# EAGLE design midi_CasioSA21.v4 (EAGLE 7.7.0)
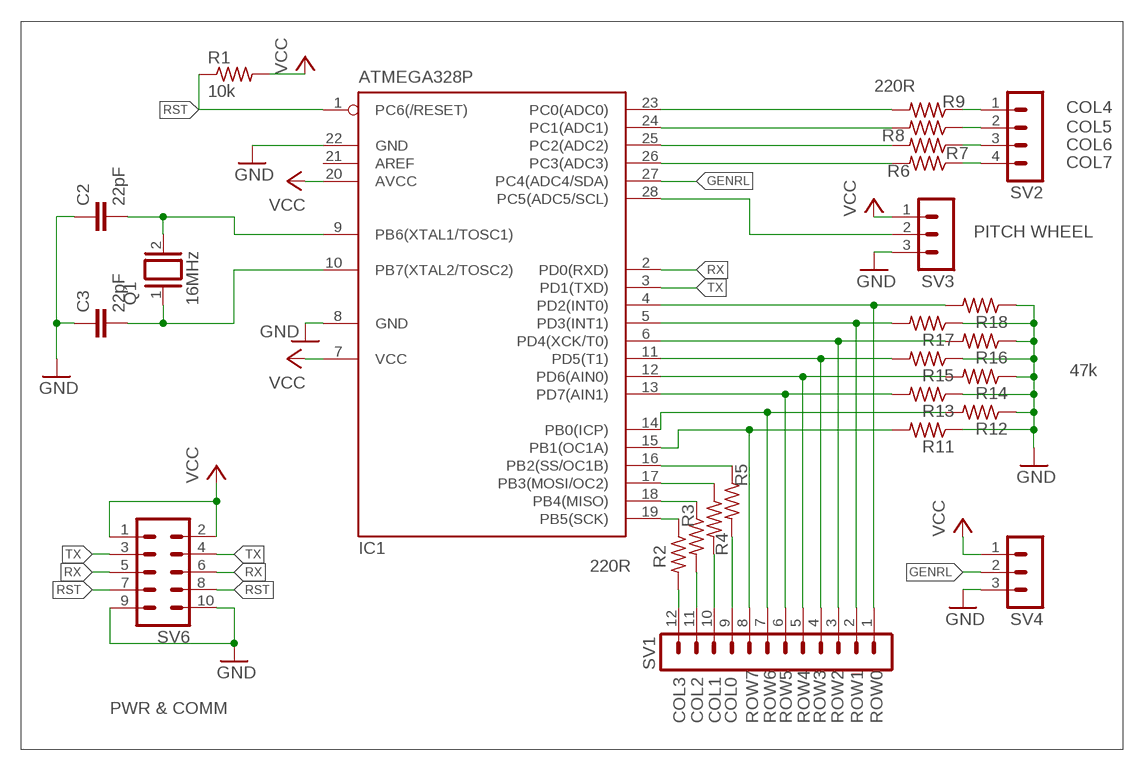
[diagram p0: schematic, sheet 1]

## Parts
C2  22pF  C-EU025-025X050  [C025-025X050]
C3  22pF  C-EU025-025X050  [C025-025X050]
IC1  ATMEGA328P  MEGA8-P  [DIL28-3]
Q1  16MHz  XTAL/S  [QS]
R1  10k  R-US_0204/7  [0204/7]
R2  R-US_0204/5  [0204/5]
R3  R-US_0204/2V  [0204V]
R4  R-US_0204/2V  [0204V]
R5  R-US_0204/2V  [0204V]
R6  R-US_0204/5  [0204/5]
R7  R-US_0204/5  [0204/5]
R8  R-US_0204/5  [0204/5]
R9  R-US_0204/5  [0204/5]
R11  R-US_0204/5  [0204/5]
R12  R-US_0204/5  [0204/5]
R13  R-US_0204/5  [0204/5]
R14  R-US_0204/5  [0204/5]
R15  R-US_0204/5  [0204/5]
R16  R-US_0204/5  [0204/5]
R17  R-US_0204/5  [0204/5]
R18  R-US_0204/5  [0204/5]
SV1  MA12-1  [MA12-1]
SV2  MA04-1  [MA04-1]
SV3  MA03-1  [MA03-1]
SV4  MA03-1  [MA03-1]
SV6  MA05-2  [MA05-2]

## Nets
GENRL: IC1.27(PC4(ADC4/SDA)) SV4.2
GND: C2.1 C3.1 IC1.8(GND) IC1.22(GND) R11.1 R12.1 R13.1 R14.1 R15.1 R16.1 R17.1 R18.1 SV3.3 SV4.3 SV6.9 SV6.10
N$1: C2.2 IC1.9(PB6(XTAL1/TOSC1)) Q1.2
N$2: C3.2 IC1.10(PB7(XTAL2/TOSC2)) Q1.1
N$3: IC1.4(PD2(INT0)) R18.2 SV1.1
N$4: IC1.5(PD3(INT1)) R17.2 SV1.2
N$5: IC1.6(PD4(XCK/T0)) R16.2 SV1.3
N$6: R5.2 SV1.9
N$7: IC1.11(PD5(T1)) R15.2 SV1.4
N$8: IC1.12(PD6(AIN0)) R14.2 SV1.5
N$9: IC1.13(PD7(AIN1)) R13.2 SV1.6
N$10: IC1.14(PB0(ICP)) R12.2 SV1.7
N$11: IC1.15(PB1(OC1A)) R11.2 SV1.8
N$12: IC1.19(PB5(SCK)) R2.1
N$13: IC1.18(PB4(MISO)) R3.1
N$14: IC1.17(PB3(MOSI/OC2)) R4.1
N$15: IC1.16(PB2(SS/OC1B)) R5.1
N$16: R4.2 SV1.10
N$17: R3.2 SV1.11
N$18: R2.2 SV1.12
N$19: IC1.23(PC0(ADC0)) R9.2
N$20: IC1.24(PC1(ADC1)) R8.2
N$21: IC1.25(PC2(ADC2)) R7.2
N$22: IC1.26(PC3(ADC3)) R6.2
N$24: R9.1 SV2.1
N$25: R8.1 SV2.2
N$26: R7.1 SV2.3
N$27: R6.1 SV2.4
PITCH_BEND: IC1.28(PC5(ADC5/SCL)) SV3.2
RST: IC1.1(PC6(/RESET)) R1.1 SV6.7 SV6.8
RX: IC1.2(PD0(RXD)) SV6.5 SV6.6
TX: IC1.3(PD1(TXD)) SV6.3 SV6.4
VCC: IC1.7(VCC) IC1.20(AVCC) R1.2 SV3.1 SV4.1 SV6.1 SV6.2
Unconnected: IC1.21(AREF)

## Notes on the sheet
- 220R
- COL4
- COL5
- COL6
- COL7
- PITCH WHEEL
- 47k
- 220R
- PWR & COMM
- COL3 | COL2 | COL1 | COL0 | ROW7 | ROW6 | ROW5 | ROW4 | ROW3 | ROW2 | ROW1 | ROW0

## Library data of the parts
C2 C3 = rcl:C-EU: CAPACITOR, European symbol
IC1 = atmel:MEGA8-P: MICROCONTROLLER 8 Kbytes FLASH, 1 kbytes SRAM, 512 bytes EEPROM, USART, 4-channel 10 bit ADC, 2-channel 8 bit ADC Pin compatible with Atmega48, ATMega88, ATMega168 Source: avr.lbr; OC_FARNELL: unknown; OC_NEWARK: unknown
Q1 = special:XTAL/S: CRYSTAL
R1-R9 R11-R18 = rcl:R-US_: RESISTOR, American symbol
SV1 = con-lstb:MA12-1: PIN HEADER; OC_FARNELL: unknown; OC_NEWARK: unknown
SV2 = con-lstb:MA04-1: PIN HEADER; OC_FARNELL: unknown; OC_NEWARK: unknown
SV3 SV4 = con-lstb:MA03-1: PIN HEADER; OC_FARNELL: unknown; OC_NEWARK: unknown
SV6 = con-lstb:MA05-2: PIN HEADER; OC_FARNELL: unknown; OC_NEWARK: unknown

## Net classes
0 default: clearance 0.6 mm
4 holla: clearance 1.5 mm

## Board
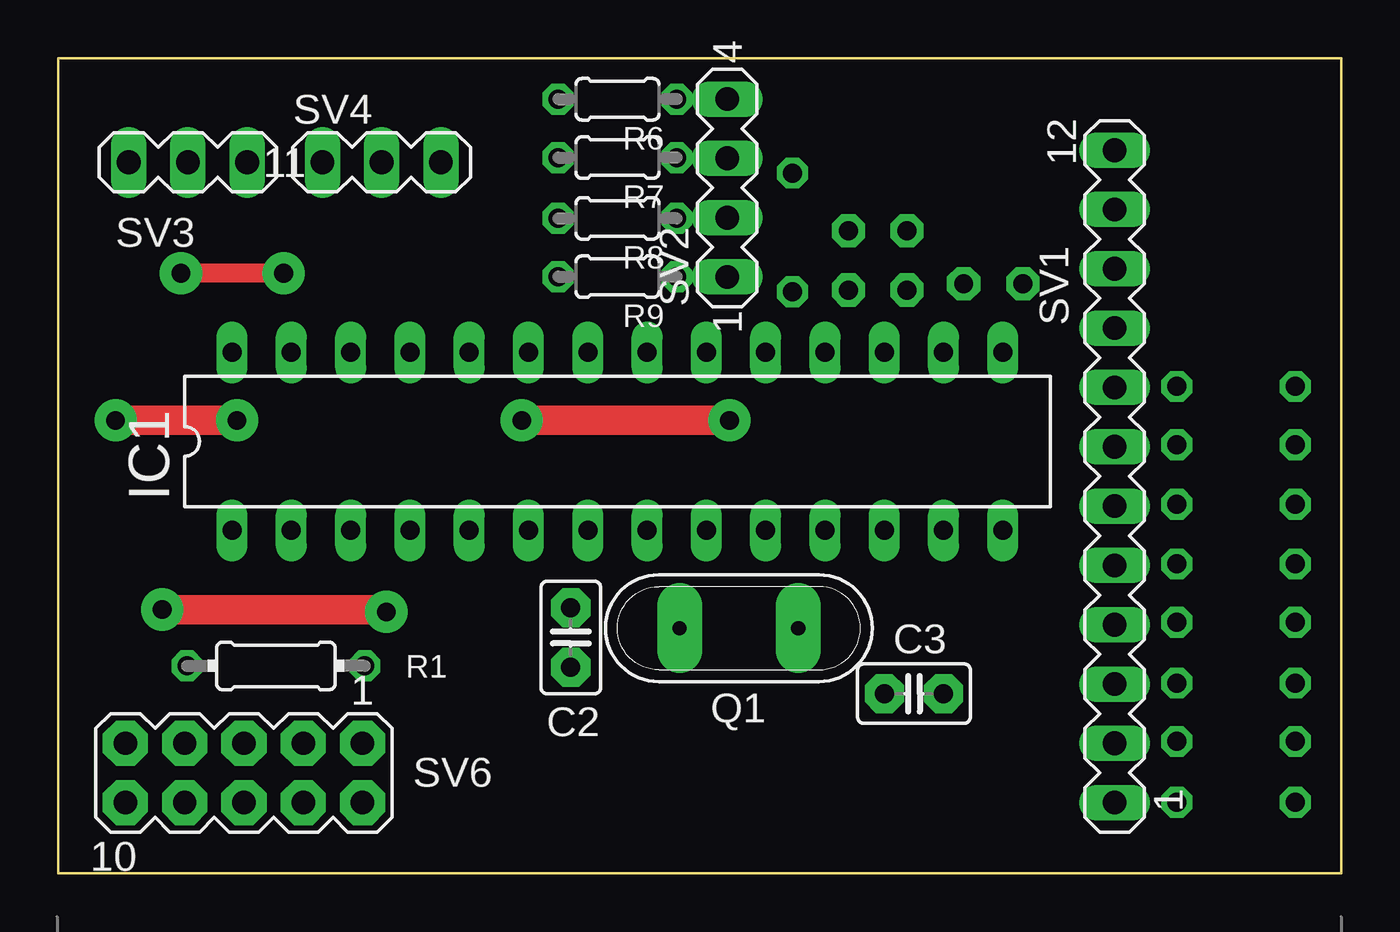
[diagram p1: board, top side]
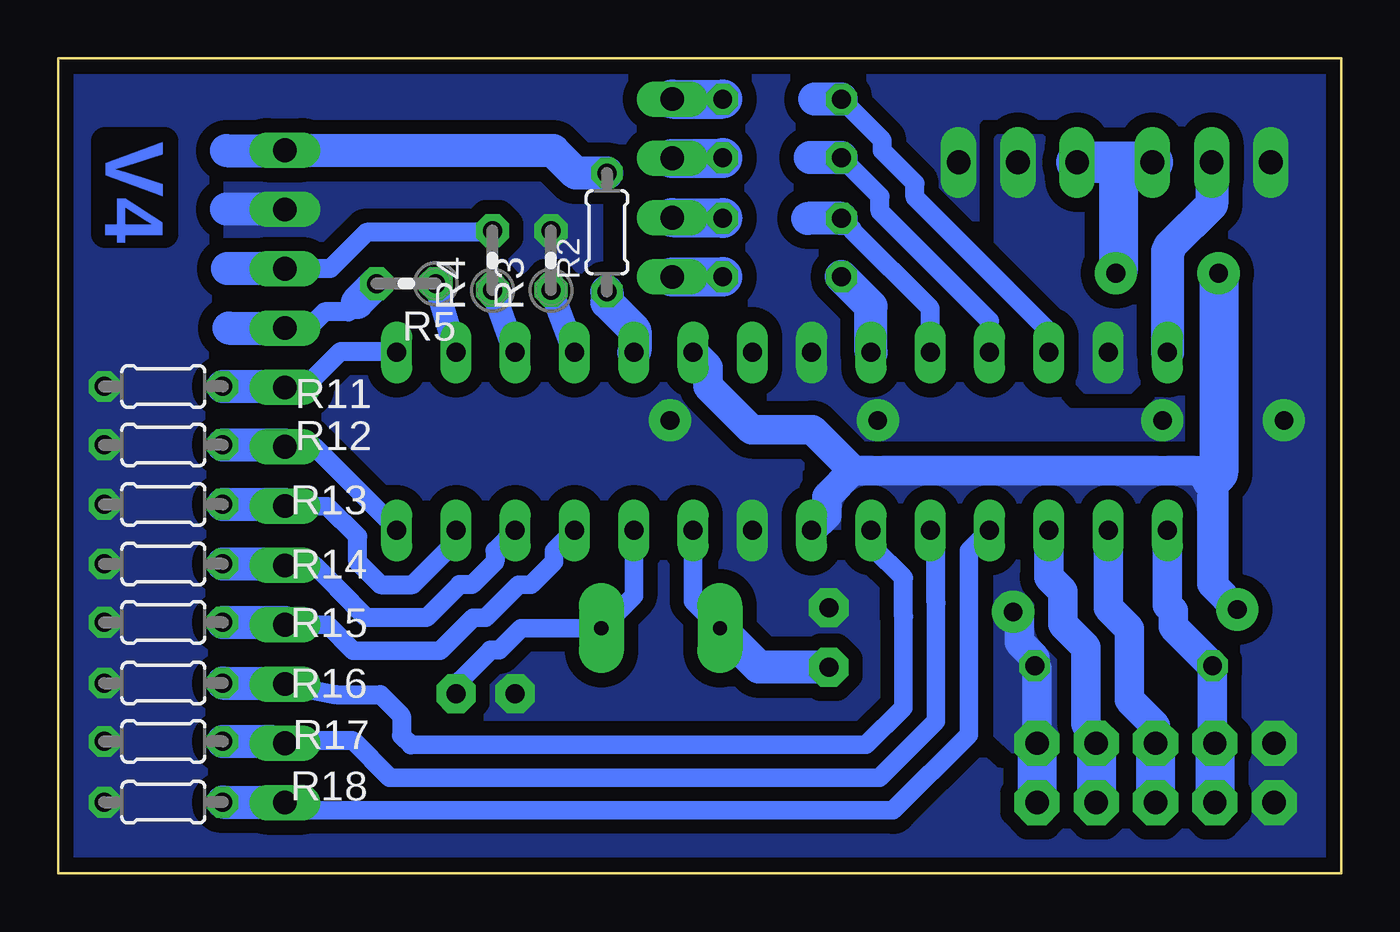
[diagram p2: board, bottom side, seen from below]

Size 54.95 x 34.9 mm. Coordinates in mm from the lower left corner, seen from the top.
Outline: 0,0 54.95,0 54.95,34.9 0,34.9 0,0
Copper layers (1*16): Top 0.035mm / dielectric 1.5mm / Bottom 0.035mm
Design rules "default *": minimum track width 0.8mm, minimum drill 24mil, track to track 0.4mm, track to pad 0.4mm, pad to pad 0.4mm, via to via 0.4mm, smd to smd 8mil, copper to edge 15mil, drill to drill 8mil, minimum pad ring 10mil, minimum via ring 8mil, stop-mask expansion 4mil, vias tented up to drill 0mil, thermal gap 10mil

### Footprints (pad centres in the part's own frame; a part is rotated, then mirrored left to right if it is on the bottom)
C025-025X050 = drill 0.813 pad 1.676 octagon: 1 -1.27,0; 2 1.27,0
DIL28-3 = drill 0.813 long: 1 -16.51,-3.81; 2 -13.97,-3.81; 3 -11.43,-3.81; 4 -8.89,-3.81; 5 -6.35,-3.81; 6 -3.81,-3.81; 7 -1.27,-3.81; 8 1.27,-3.81; 9 3.81,-3.81; 10 6.35,-3.81; 11 8.89,-3.81; 12 11.43,-3.81; 13 13.97,-3.81; 14 16.51,-3.81; 15 16.51,3.81; 16 13.97,3.81; 17 11.43,3.81; 18 8.89,3.81; 19 6.35,3.81; 20 3.81,3.81; 21 1.27,3.81; 22 -1.27,3.81; 23 -3.81,3.81; 24 -6.35,3.81; 25 -8.89,3.81; 26 -11.43,3.81; 27 -13.97,3.81; 28 -16.51,3.81
QS = drill 0.61 pad 1.93 long: 1 -2.54,0; 2 2.54,0
0204/7 = drill 0.813 octagon: 1 -3.81,0; 2 3.81,0
0204/5 = drill 0.813 octagon: 1 -2.54,0; 2 2.54,0
0204V = drill 0.813 pad 1.422 octagon: 1 -1.27,0; 2 1.27,0
MA12-1 = drill 1.016 long: 1 -13.97,0; 2 -11.43,0; 3 -8.89,0; 4 -6.35,0; 5 -3.81,0; 6 -1.27,0; 7 1.27,0; 8 3.81,0; 9 6.35,0; 10 8.89,0; 11 11.43,0; 12 13.97,0
MA04-1 = drill 1.016 long: 1 -3.81,0; 2 -1.27,0; 3 1.27,0; 4 3.81,0
MA03-1 = drill 1.016 long: 1 -2.54,0; 2 0,0; 3 2.54,0
MA05-2 = drill 1 pad 1.93 octagon: 1 -5.08,-1.27; 2 -5.08,1.27; 3 -2.54,-1.27; 4 -2.54,1.27; 5 0,-1.27; 6 0,1.27; 7 2.54,-1.27; 8 2.54,1.27; 9 5.08,-1.27; 10 5.08,1.27

### Placement (x,y rotation side)
C2  21.95,10.1 270 top
C3  36.65,7.7 0 top
IC1  23.95,18.5 0 top
Q1  29.15,10.5 180 top
R1  9.32,8.88 0 top
R2  31.45,27.45 90 bottom
R3  33.85,26.25 90 bottom
R4  36.35,26.25 90 bottom
R5  40.05,25.25 180 bottom
R6  23.95,33.15 180 top
R7  23.95,30.65 180 top
R8  23.95,28.05 180 top
R9  23.95,25.55 180 top
R11  50.45,20.85 0 bottom
R12  50.45,18.35 0 bottom
R13  50.45,15.8 0 bottom
R14  50.45,13.25 0 bottom
R15  50.45,10.75 0 bottom
R16  50.45,8.15 0 bottom
R17  50.45,5.65 0 bottom
R18  50.45,3.05 0 bottom
SV1  45.25,17 90 top
SV2  28.65,29.35 90 top
SV3  5.55,30.45 180 top
SV4  13.85,30.45 0 top
SV6  7.95,4.3 180 top

### Tracks (layer width: path | path; a pad name or v marks a point on that pad's centre or on a via)
GENRL
  pour Bottom (isolate 0.61, no thermals): 12.65,31.45 12.55,31.45 12.55,29.25 9.55,29.25 9.55,28.85 9.55,27.45 8.05,25.95 8.05,21.65 9.05,20.65 10.95,20.65 11.35,21.05 11.35,23.25 14.75,26.65 14.75,31.45 14.65,31.55 12.85,31.55 12.75,31.45
GND  (via drill 0.8 pad 1.8)
  Top 1.27: v28.75,19.4 v19.85,19.4 | v7.65,19.4 v2.45,19.4
  pour Bottom (isolate 0.61, rank 3, no thermals): 0.05,34.9 -0.05,0 54.95,0 54.95,34.9
N$1
  Bottom 0.8: IC1.9 27.76,11.65 Q1.2
  Bottom 1.422: C2.2 24.94,8.83 Q1.2
N$2
  Bottom 0.8: IC1.10 30.3,11.89 Q1.1 35.12,10.5 36.07,9.56
  Bottom 0.813: 36.07,9.56 36.44,9.56 37.75,8.25 37.75,7.87 C3.2
N$3
  Bottom 0.8: IC1.4 15.94,13.81 15.94,13.34 15.95,13.33 15.95,5.94 19.19,2.7 45.62,2.7 SV1.1
  Bottom 1.422: R18.2 45.25,3.05 SV1.1
N$4
  Bottom 0.8: 17.35,11.58 17.35,6.52 19.77,4.1 40.75,4.1
  Bottom 0.813: 40.75,4.1 42.35,5.7 45.25,5.7 SV1.2 45.25,5.65 45.82,5.65 | 17.35,11.58 17.35,14.44 IC1.5
  Bottom 1.422: R17.2 45.82,5.65
N$5
  Bottom 0.8: 18.75,11 18.75,7.1 20.35,5.5 39.85,5.5
  Bottom 0.813: 45.3,8.1 43.05,7.65 41.15,7.65 40.25,6.75 40.25,5.9 39.85,5.5 | 18.75,11 18.75,12.65 20.05,13.95 20.05,14.6 IC1.6
  Bottom 1.422: R16.2 45.25,8.15 SV1.3 45.3,8.1
N$6
  Bottom 0.813: SV1.9 44.25,23.35 43.55,24.05 42.52,24.05 42.52,24.08 42.15,24.45
  Bottom 1.422: 44.45,23.35 SV1.9 47.65,23.35 | R5.2 41.35,25.25 42.15,24.45
N$7
  Bottom 0.8: IC1.11 33.72,13.81 33.72,13.34 34.69,12.37 35.23,12.37 36.65,10.96 37.19,10.96 38.6,9.54 42.32,9.54 43.43,10.65 SV1.4
  Bottom 1.422: R15.2 45.25,10.75 SV1.4
N$8
  Bottom 0.8: SV1.5 43.98,13.19 42.97,12.18
  Bottom 0.813: IC1.12 36.25,13.82 36.25,13.34 37.23,12.36 37.77,12.36 39.18,10.95 41.74,10.95 42.97,12.18
  Bottom 1.422: R14.2 45.25,13.25 SV1.5
N$9
  Bottom 0.8: 42.13,14.43 43.43,15.73 SV1.6
  Bottom 0.813: 42.13,14.43 42.13,13.34 41.15,12.36 39.77,12.36 38.13,14 38.05,14 38.05,14.56 IC1.13
  Bottom 1.422: R13.2 45.25,15.8 SV1.6
N$10
  Bottom 0.8: IC1.14 40.72,14.95 40.72,15.01 43.98,18.27 SV1.7
  Bottom 0.813: IC1.14 40.71,14.94 40.71,15.01
  Bottom 1.422: R12.2 45.25,18.35 SV1.7
N$11
  Bottom 0.813: SV1.8 44.39,20.81 42.85,22.35 40.5,22.35 IC1.15
  Bottom 1.422: R11.2 45.25,20.85 SV1.8
N$12
  Bottom 1.422: R2.1 31.45,24.45 30.25,23.25 30.25,22.36 IC1.19
N$13
  Bottom 1.016: R3.1 IC1.18
N$14
  Bottom 1.016: R4.1 IC1.17
N$15
  Bottom 1.016: R5.1 IC1.16
N$16
  Bottom 0.813: R4.2 36.42,27.45 41.75,27.45 43.3,25.9 44.65,25.9
  Bottom 1.422: SV1.10 | SV1.10 47.7,25.9 | SV1.10 44.65,25.9 44.45,25.9
N$17
  Bottom 0.813: R3.2 33.95,27.62
  Bottom 1.422: SV1.11 45.27,28.45 47.75,28.45
  pour Bottom (isolate 0.61, no thermals): 47.75,30.45 43.15,30.35 41.85,30.65 32.75,30.65 32.45,30.35 31.75,29.15 31.75,24.85 36.15,25.05 36.15,27.85 41.95,27.85 43.15,27.05 47.75,27.15
N$18
  Bottom 0.813: 45.93,30.95 SV1.12
  Bottom 1.422: SV1.12 45.33,30.95 | 47.75,30.95 45.33,30.95 | R2.2 32.79,29.99 33.75,30.95 45.33,30.95
N$19
  Bottom 1.422: IC1.23 20.14,24.28 R9.2
N$20
  Bottom 0.813: IC1.24 17.6,24.2 20.95,27.55 20.95,27.59 R8.2
  Bottom 1.422: R8.2 22.85,28.05
N$21
  Bottom 0.813: IC1.25 15.06,23.66 19.75,28.35 19.75,28.99 R7.2
  Bottom 1.422: R7.2 22.75,30.65
N$22
  Bottom 0.813: IC1.26 12.52,23.22 18.25,28.95 18.25,29.55 19.65,30.95 19.65,31.39 R6.2
  Bottom 1.422: R6.2 22.55,33.15
N$24
  Bottom 1.676: SV2.1 R9.1
N$25
  Bottom 1.676: SV2.2 26.49,28.08 R8.1
N$26
  Bottom 1.676: SV2.3 26.49,30.62 R7.1
N$27
  Bottom 1.676: SV2.4 R6.1
PITCH_BEND
  Bottom 1.422: SV3.2 5.55,28.65 7.35,26.85 7.35,26.75 7.44,26.66 IC1.28
RST
  Bottom 1.27: IC1.1 7.44,11.49 7.19,11.24 7.19,10.57 R1.1 5.51,5.67 5.41,5.67 SV6.7
  Bottom 1.676: SV6.7 SV6.8
RX
  Bottom 1.27: IC1.2 9.98,11.38 9.06,10.47 9.06,7.43 7.95,6.31 SV6.5
  Bottom 1.676: SV6.5 SV6.6
TX
  Bottom 1.27: IC1.3 12.52,12.69 11.91,12.08 11.91,10.67 10.93,9.69 10.93,6.41 SV6.3
  Bottom 1.676: SV6.3 SV6.4
VCC  (via drill 0.8 pad 1.8)
  Top 0.813: v9.65,25.7 v5.25,25.7
  Top 1.27: v4.45,11.3 13.95,11.3 v14.05,11.2
  Bottom 0.813: v4.45,11.3 5.25,12.1 5.25,16.65 5.45,16.85 5.55,16.85 5.75,16.85
  Bottom 1.27: SV6.1 13.03,8.79 R1.2 13.13,9.24 13.79,9.9 13.79,10.93 v14.05,11.2 | 20.93,17.25 22.04,16.14 22.04,15.33 IC1.7 | 20.93,17.25 5.85,17.25 5.85,16.95 5.75,16.85 | v4.45,11.3 5.54,12.39 5.54,16.14 | IC1.20 27.11,21.66 27.11,20.86 25.25,19 22.65,19 20.93,17.27 20.93,17.25
  Bottom 1.676: SV6.1 SV6.2 | 9.65,30.45 9.55,30.35 9.55,25.8 v9.65,25.7 | v5.25,25.7 5.25,17.15 5.55,16.85
  Bottom 1.778: SV4.1 9.65,30.45 SV3.1
  pour Bottom (isolate 0.61, no thermals): 14.05,5.25 15.15,6.25 15.25,12.65 14.65,13.95 12.95,12.75 12.15,9.85 11.75,6.65 12.45,4.95
  pour Bottom (isolate 0.61, no thermals): 6.25,17.75 21.05,17.75 22.35,16.55 22.35,14.85 6.45,14.85 6.05,15.25 6.05,17.65

### Text on the board
Bottom: V4